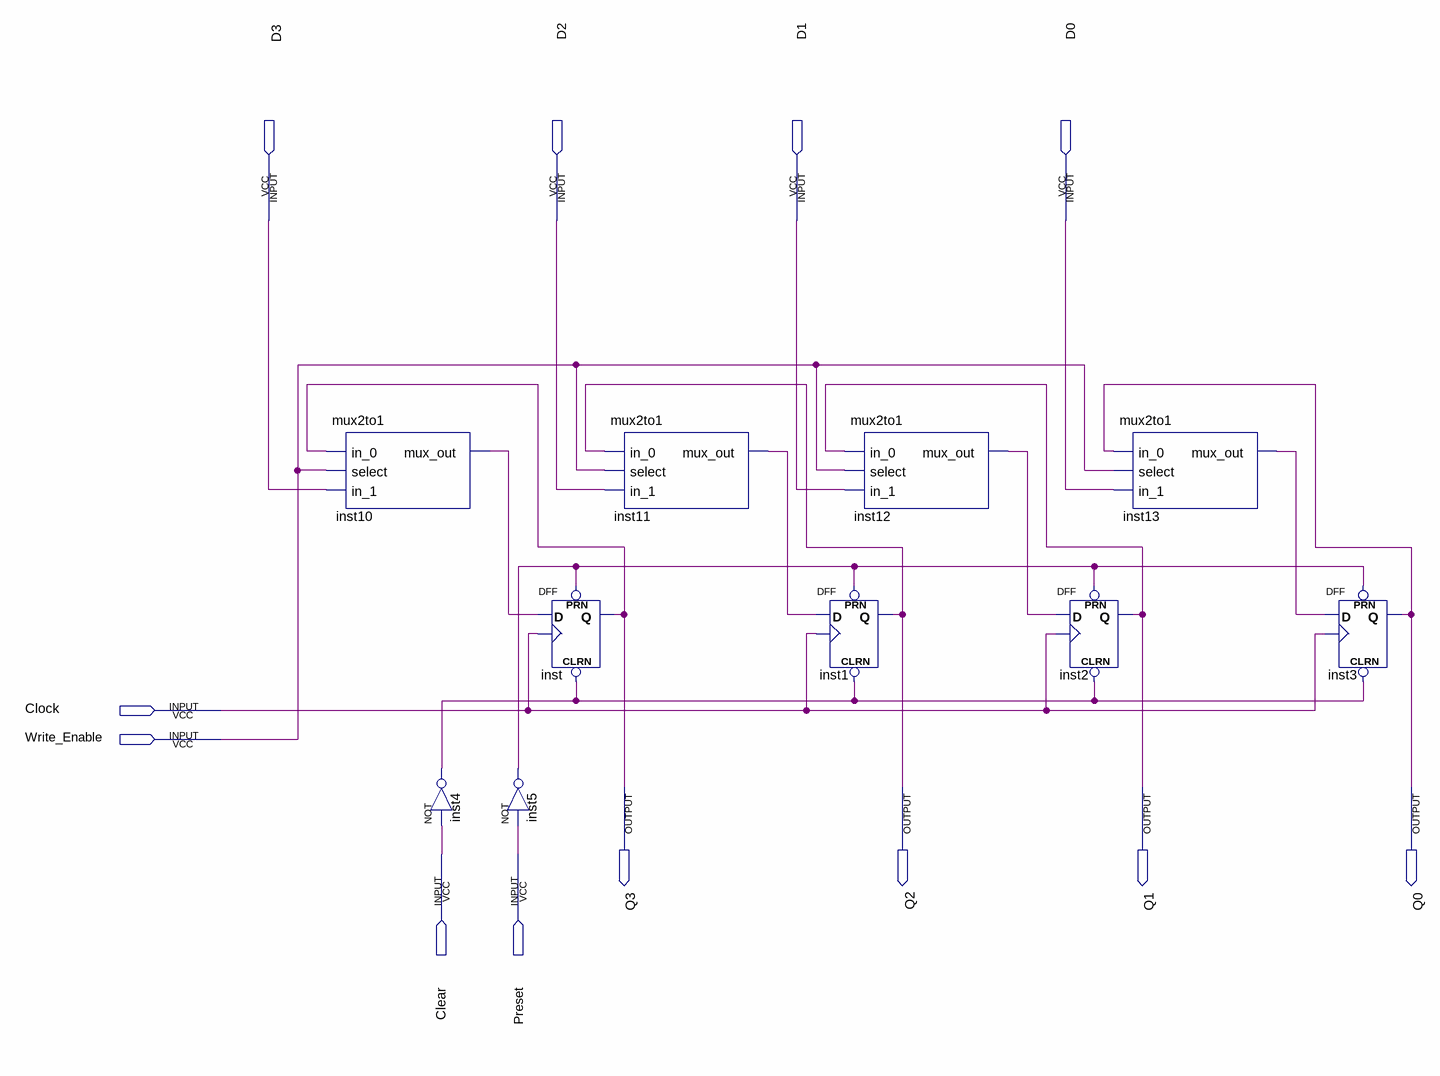
[diagram p0: schematic sheet]
// Quartus schematic single_row_four_bit.bdf as structural Verilog: 10 symbols, 12 pins
module single_row_four_bit (
  input  D3,
  input  D2,
  input  D1,
  input  D0,
  input  Clock,
  input  Write_Enable,
  input  Clear,
  input  Preset,
  output Q3,
  output Q2,
  output Q1,
  output Q0
);

  wire inst4_out, inst5_out, inst10_mux_out, inst11_mux_out, inst12_mux_out, inst13_mux_out;

  mux2to1 inst10 (.in_0(Q3), .select(Write_Enable), .in_1(D3), .mux_out(inst10_mux_out));
  not inst4 (inst4_out, Clear);
  DFF inst (.CLRN(inst4_out), .CLK(Clock), .D(inst10_mux_out), .PRN(inst5_out), .Q(Q3));
  not inst5 (inst5_out, Preset);
  mux2to1 inst11 (.in_0(Q2), .select(Write_Enable), .in_1(D2), .mux_out(inst11_mux_out));
  mux2to1 inst12 (.in_0(Q1), .select(Write_Enable), .in_1(D1), .mux_out(inst12_mux_out));
  DFF inst1 (.CLRN(inst4_out), .CLK(Clock), .D(inst11_mux_out), .PRN(inst5_out), .Q(Q2));
  DFF inst2 (.CLRN(inst4_out), .CLK(Clock), .D(inst12_mux_out), .PRN(inst5_out), .Q(Q1));
  mux2to1 inst13 (.in_0(Q0), .select(Write_Enable), .in_1(D0), .mux_out(inst13_mux_out));
  DFF inst3 (.CLRN(inst4_out), .CLK(Clock), .D(inst13_mux_out), .PRN(inst5_out), .Q(Q0));
endmodule
